# EasyEDA Pro project 单向户外电源_明月班.epro, schematic Schematic4
Board Name: Board1; Create Date: 2025-11-09; Page Name: P1; Project Name: 单向户外电源; Schematic Name: Schematic4; Update Date: 2025-11-10; Company: 嘉立创EDA; Page Size: A4; Version: V1.0
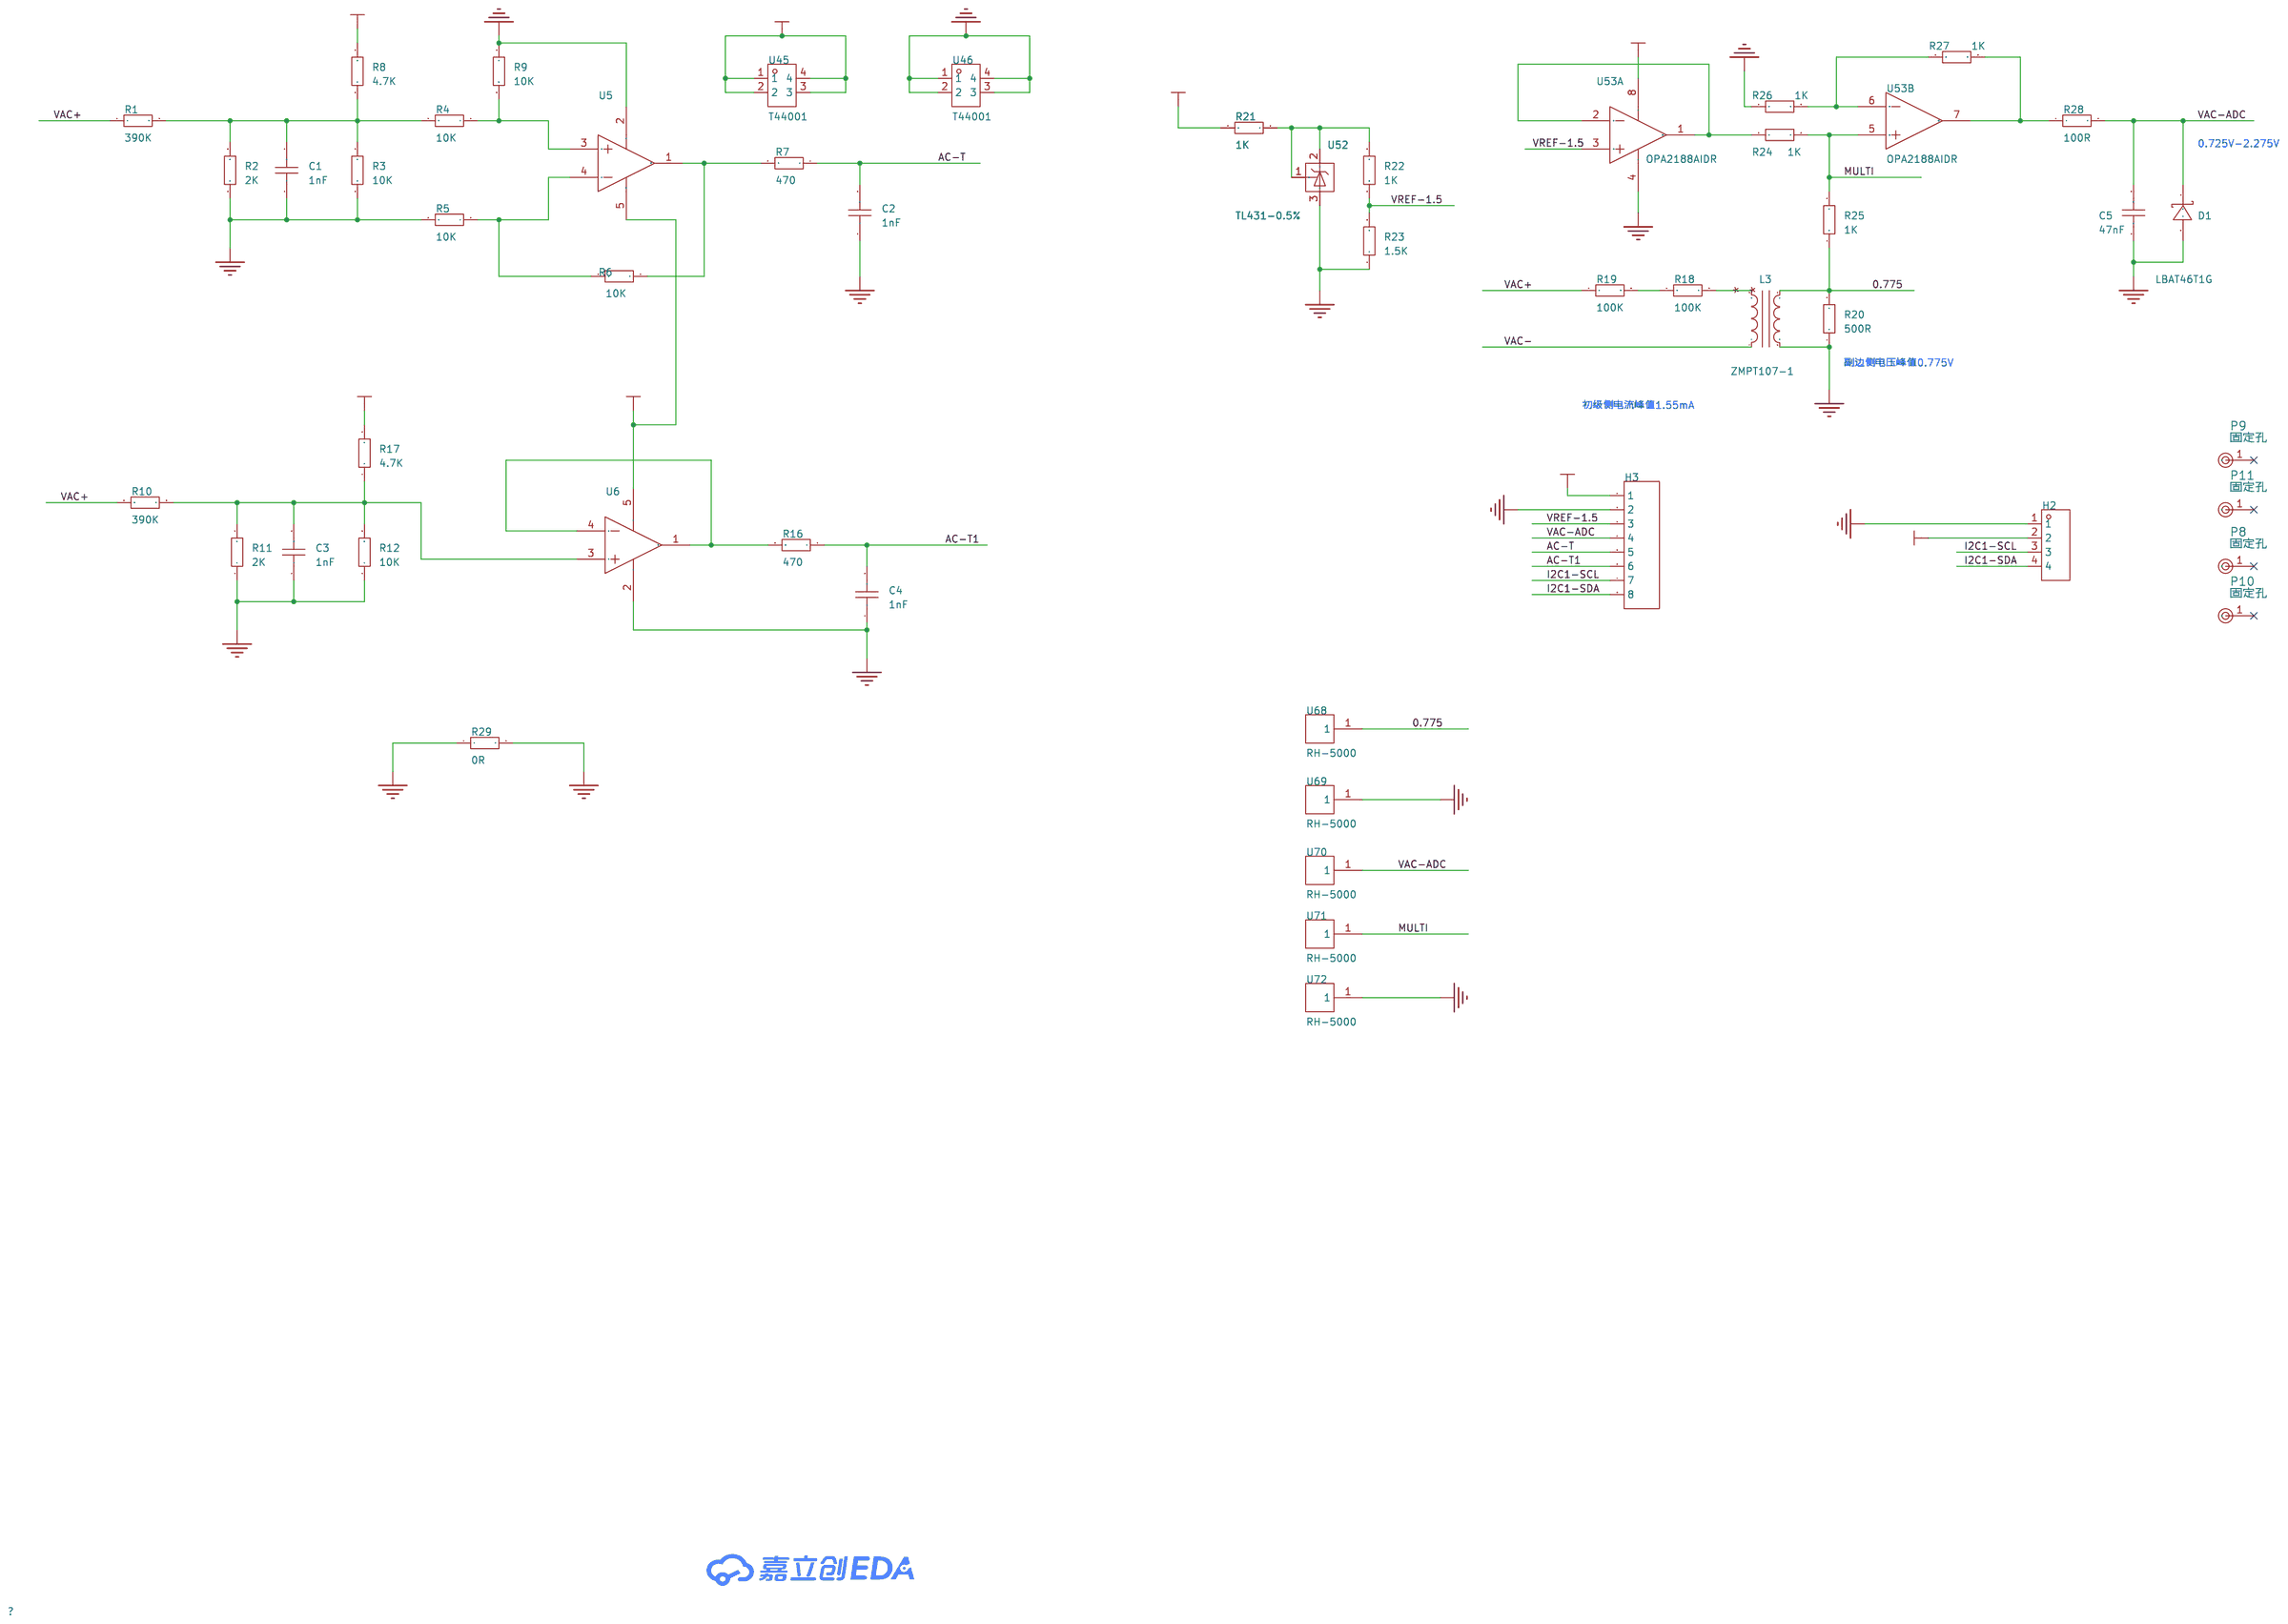
[diagram p5: schematic sheet]

## Parts
C1  1nF  [C0805]
C2  1nF  [C0805]
C3  1nF  [C0805]
C4  1nF  [C0805]
C5  47nF  [C0805]
D1  LBAT46T1G  [SOD-123_L2.7-W1.6-LS3.7-RD-4]
H2  -  [HDR-TH_4P-P2.54-V-F]
H3  -  [HDR-TH_8P-P2.54-V-M]
L3  ZMPT107-1  [XFMR-TH_ZMPT107-1]
P8  固定孔  [固定孔]
P9  固定孔  [固定孔]
P10  固定孔  [固定孔]
P11  固定孔  [固定孔]
R1  390K  [R0805]
R2  2K  [R0805]
R3  10K  [R0805]
R4  10K  [R0805]
R5  10K  [R0805]
R6  10K  [R0805]
R7  470  [R0805]
R8  4.7K  [R0805]
R9  10K  [R0805]
R10  390K  [R0805]
R11  2K  [R0805]
R12  10K  [R0805]
R16  470  [R0805]
R17  4.7K  [R0805]
R18  100K  [R0805]
R19  100K  [R0805]
R20  500R  [R0805]
R21  1K  [R0805]
R22  1K  [R0805]
R23  1.5K  [R0805]
R24  1K  [R0805]
R25  1K  [R0805]
R26  1K  [R0805]
R27  1K  [R0805]
R28  100R  [R0805]
R29  0R  [R0805]
U5  TLV333IDBVR  [SOT-23-5_L2.9-W1.6-P0.95-LS2.8-BL]
U6  TLV333IDBVR  [SOT-23-5_L2.9-W1.6-P0.95-LS2.8-BL]
U45  T44001  [CONN-TH_T44001]
U46  T44001  [CONN-TH_T44001]
U52  TL431-0.5%  [SOT-23-3_L2.9-W1.6-P1.90-LS2.8-BR]
U53  OPA2188AIDR  [SOIC-8_L4.9-W3.9-P1.27-LS6.0-BL]  (sections 1,2)
U68  RH-5000  [TEST-TH_BD2.54-P1.4_RED]
U69  RH-5000  [TEST-TH_BD2.54-P1.4_RED]
U70  RH-5000  [TEST-TH_BD2.54-P1.4_RED]
U71  RH-5000  [TEST-TH_BD2.54-P1.4_RED]
U72  RH-5000  [TEST-TH_BD2.54-P1.4_RED]

## Library data of the parts
C1-C5 = CAP_0805: Supplier Footprint: 0805
D1 = LBAT46T1G: 正向压降(Vf):250mV;直流反向耐压(Vr):100V;整流电流:150mA;; LCSC Part Name: 电压:100V 电流:150mA; Supplier Part: C383177; Manufacturer: LRC(乐山无线电); Supplier Footprint: SOD-123; JLCPCB Part Class: 扩展库; Datasheet: https://atta.szlcsc.com/upload/public/pdf/source/20190402/C383177_91B671A097C80DD68CF84040E8658840.pdf; Supplier: LCSC; Forward Voltage (Vf@If): 250mV; Reverse Voltage (Vr): 100V; Rectified Current: 150mA; Reverse Leakage Current (Ir): 500nA
H2 = HDR-F_2.54_1x4P: Supplier Part: C2718488; Supplier Footprint: 插件
H3 = HDR-M_2.54_1x8P: Supplier Part: C124381; Supplier Footprint: 插件
L3 = ZMPT107-1_C125191: 类型:电压互感器;匝数比:1:1;额定输入电流:2mA;额定输出电流:2mA;频率:-;次级侧电感值:-;; Supplier Part: C125191; Manufacturer: 择明朗熙; Supplier Footprint: 插件; JLCPCB Part Class: 扩展库; Datasheet: https://item.szlcsc.com/datasheet/ZMPT107-1/136467.html; Supplier: LCSC; Type: 电压互感器; Turns Ratio: 1:1; Rated input Current: 2mA; Rated Output Current: 2mA; Linearity: 0.2%
P8-P11 = 固定孔
R1-R12 R16-R29 = Res_0805: Supplier Footprint: 0805
U5 U6 = TLV333IDBVR: 放大器数:单路;增益带宽积(GBP):350kHz;输入偏置电流(Ib):70pA;输入失调电压(Vos):2uV;压摆率(SR):0.16V/us;轨到轨:-;; Supplier Part: C473369; Manufacturer: TI(德州仪器); Supplier Footprint: SOT-23-5; JLCPCB Part Class: 扩展库; Datasheet: https://www.ti.com/cn/lit/gpn/tlv333; Supplier: LCSC; Number of Circuits: 单路; Gain Bandwidth Product(GBP): 350kHz; Current - Input Bias(Ib): 70pA; Voltage - Input Offset(Vos): 2uV; Slew Rate(SR): 0.16V/us; Operating Temperature: -40℃~+125℃
U45 U46 = T44001: LCSC Part Name: 四脚 M4 二件套; Supplier Part: C481447; Manufacturer: XFCN(兴飞); Supplier Footprint: 插件; JLCPCB Part Class: 扩展库; Datasheet: https://atta.szlcsc.com/upload/public/pdf/source/20200107/C481448_4214B4EB74A46B70BD82BA8A456D4EDD.pdf; Supplier: LCSC
U52 = TL431-0.5%_C2874163: LCSC Part Name: TL431-0.5% 停产; Supplier Part: C2874163; Manufacturer: GOFORD(谷峰); Supplier Footprint: SOT-23; JLCPCB Part Class: 扩展库; Datasheet: https://atta.szlcsc.com/upload/public/pdf/source/20210810/02A0BB82282FBCACF58140E8DCCF3C6A.pdf; Supplier: LCSC
U53 = OPA2188AIDR: 放大器数:双路;增益带宽积(GBP):2MHz;输入偏置电流(Ib):160pA;输入失调电压(Vos):6uV;压摆率(SR):0.8V/us;轨到轨:轨到轨输出;; LCSC Part Name: OPA2188AIDR  零漂移; Supplier Part: C17271; Manufacturer: TI(德州仪器); Supplier Footprint: SOIC-8; JLCPCB Part Class: 扩展库; Datasheet: https://www.ti.com/cn/lit/gpn/opa2188; Supplier: LCSC; Number of Channels: 双路; Gain Bandwidth Product: 2MHz; Ib - Input Bias Current: 160pA; Vos - Input Offset Voltage: 6uV; Common Mode Rejection Ratio(CMRR): 146dB; Slew Rate: 0.8V/us; Output Current: 18mA; Rail to Rail: 轨到轨输出; Quiescent Current(Iq): 475uA; Operating Temperature: -40℃~+105℃; Single Supply: 4V~36V; Dual Supply: -18V~-2V；2V~18V; Maximum Power Supply Range (Vdd-Vss): 36V; Noise density(eN): 8.8nV/√Hz@1kHz; Input Offset Current(Ios): 320pA
U68-U72 = RH-5000: LCSC Part Name: PCB电路板测试点/测试针; Supplier Part: C5277086; Manufacturer: 荣和; JLCPCB Part Class: 扩展库; Datasheet: https://atta.szlcsc.com/upload/public/pdf/source/20230704/1671C2774A3D6CEDC1FD6AAF48538C87.pdf; Supplier: LCSC

## Nets
5V: H2.2 H3.1 R8.2 R17.2 R21.1 U5.5(V+) U6.5(V+) U53.8(V+)
GND: C1.1 C2.1 C3.1 C4.1 C5.1 D1.2(A) H2.1 H3.2 L3.2 R2.1 R3.1 R5.2 R9.1 R11.1 R12.1 R20.1 R23.1 R26.1 R29.2 U5.2(V-) U6.2(V-) U52.3(A) U53.4(V-) U69.1 U72.1
0.775: L3.1 R20.2 R25.1 U68.1
AC-T: C2.2 H3.5 R7.1
AC-T1: C4.2 H3.6 R16.1
I2C1-SCL: H2.3 H3.7
I2C1-SDA: H2.4 H3.8
MULTI: R24.2 R25.2 U53.5(IN B+) U71.1
VAC+: R1.1 R10.1 R19.1 U45.1 U45.2 U45.3 U45.4
VAC-: L3.4 R29.1 U46.1 U46.2 U46.3 U46.4
VAC-ADC: C5.2 D1.1(C) H3.4 R28.2 U70.1
VREF-1.5: H3.3 R22.1 R23.2 U53.3(IN A+)
$1N374: C1.2 R1.2 R2.2 R3.2 R4.2 R8.1
$1N496: R4.1 R9.2 U5.3(IN+)
$1N538: R6.1 R7.2 U5.1(OUT)
$1N1143: C3.2 R10.2 R11.2 R12.2 R17.1 U6.3(IN+)
$1N1250: R16.2 U6.1(OUT) U6.4(IN-)
$1N1290: R5.1 R6.2 U5.4(IN-)
$1N1633: L3.3 R18.2
$1N1692: R18.1 R19.2
$1N1877: R21.2 R22.2 U52.1(R) U52.2(K)
$1N2322: R24.1 U53.1(OUT A) U53.2(IN A-)
$1N2536: R26.2 R27.1 U53.6(IN B-)
$1N2575: R27.2 R28.1 U53.7(OUT B)

Not connected (* = marked no-connect by the designer): P8 1(3mm洞)*; P9 1(3mm洞)*; P10 1(3mm洞)*; P11 1(3mm洞)*

## Notes on the sheet
- 0.725V-2.275V
- 副边侧电压峰值0.775V
- 初级侧电流峰值1.55mA
